# Altium schematic sheet Encoder.SchDoc
size A4; SheetNumber: 7; SheetTotal: 15
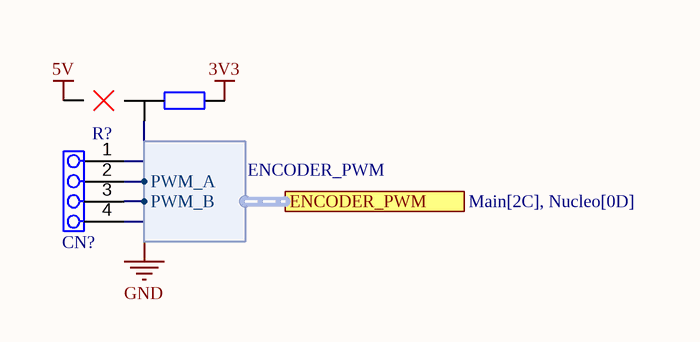
[diagram p0: Encoder.SchDoc]

## Parts
CN?  Pins 1x3  [PIN-1X4]  (value not drawn)
R?  *  [RES0603 _SELECTION]  (value not drawn)

## Ports
ENCODER_PWM (harness ENCODER_PWM, see Main[2C], Nucleo[0D])

## Harnesses
ENCODER_PWM: PWM_A, PWM_B

## Nets
3V3: R?.1
5V: R?.3
GND: CN?.4
NetCN?_1: CN?.1 R?.2
NetCN?_2: CN?.2 ; port ENCODER_PWM.PWM_A
NetCN?_3: CN?.3 ; port ENCODER_PWM.PWM_B

## Notes on the sheet
- Size
- Date
- A4
- Title
- Sheet number
- Author
- Revision

## Library data of the parts
CN? = Pin-1x4: 2.54mm; Part Class: Connector; Order Code: 855-M50-3530342; CompType: M50-3530342; Distributor: Mouser; Package: SMD 1.27mm
R? = Resistor_Selection: Resistor; Value: *